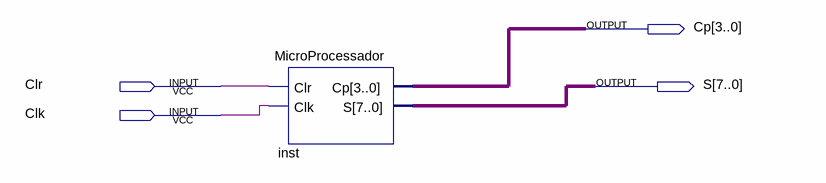
[diagram p0: schematic sheet]
// Quartus schematic Test.bdf as structural Verilog: 1 symbols, 4 pins
module Test (
  input  Clr,
  input  Clk,
  output [3:0] Cp,
  output [7:0] S
);

  MicroProcessador inst (.Clr(Clr), .Clk(Clk), .Cp(Cp), .S(S));
endmodule
